# Altium schematic sheet MotorsDrive.SchDoc: [Untitled]
size A3; Author: Nędzny Janusz; CompanyName: SensDx S.A.; Organization: SensDx S.A.; Address1: Wrocław Laboratories; SheetNumber: 1; SheetTotal: 1
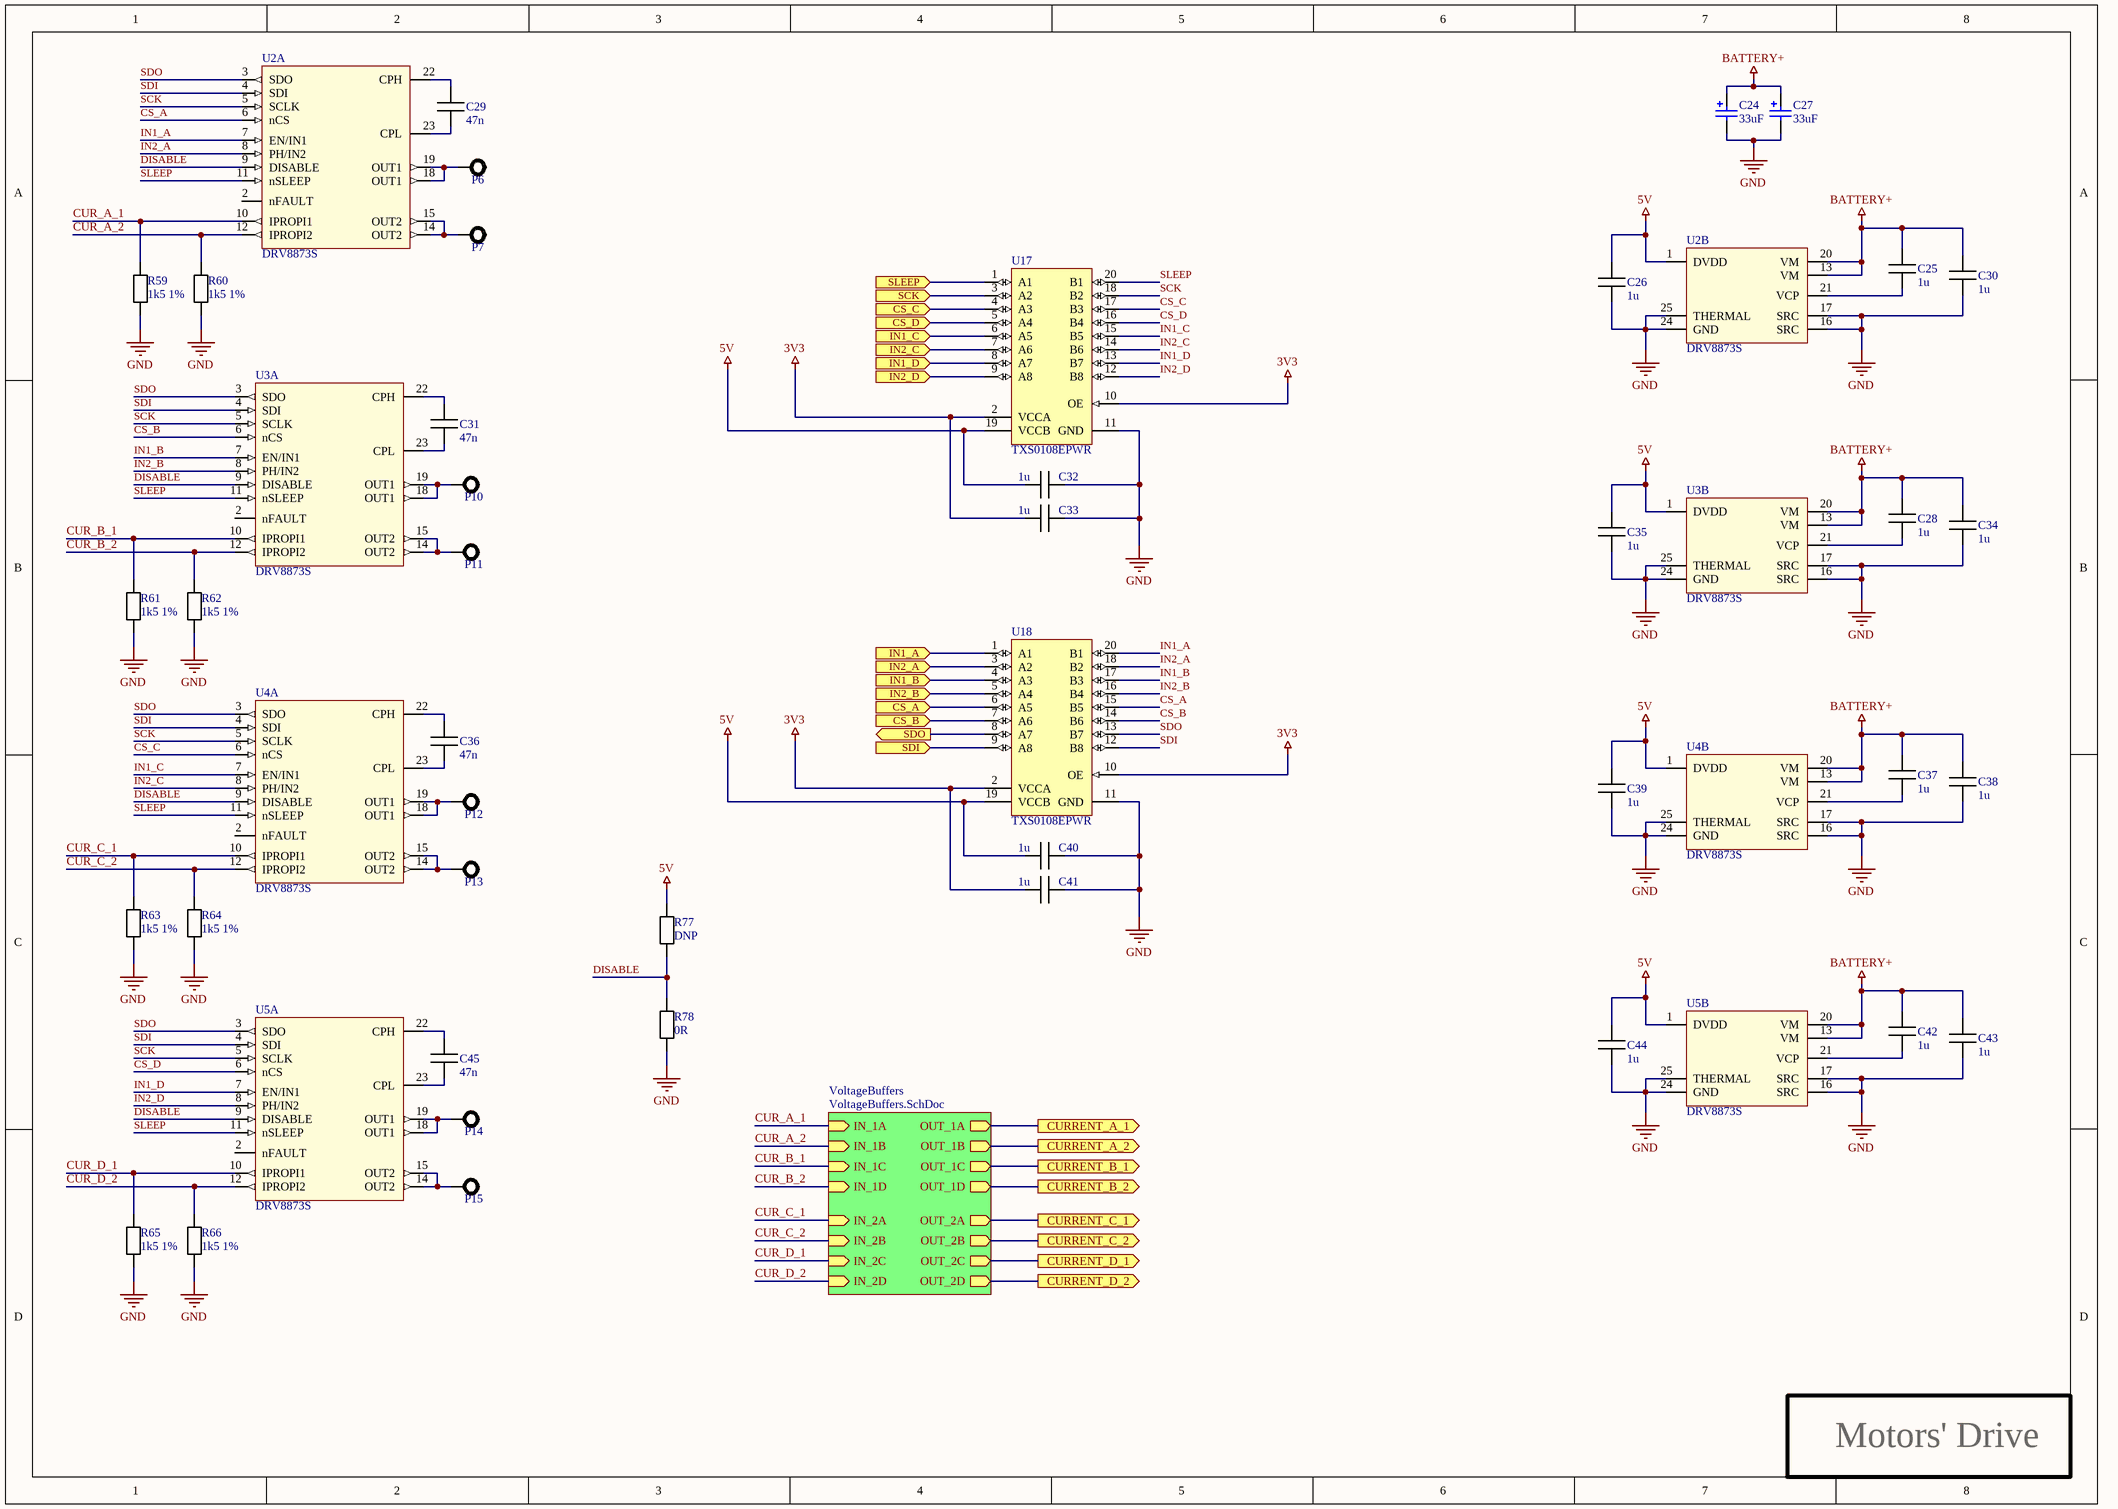
[diagram p0: MotorsDrive.SchDoc]

## Parts
C24  value 33uF  [WCAP-ASLL_6.3x5.5]  (hidden comment: 865060543004)
C25  1u  [C_0603_AUTO]
C26  1u  [C_0603_AUTO]
C27  value 33uF  [WCAP-ASLL_6.3x5.5]  (hidden comment: 865060543004)
C28  1u  [C_0603_AUTO]
C29  47n  [C_0603_AUTO]
C30  1u  [C_0603_AUTO]
C31  47n  [C_0603_AUTO]
C32  1u  [C_0603_AUTO]
C33  1u  [C_0603_AUTO]
C34  1u  [C_0603_AUTO]
C35  1u  [C_0603_AUTO]
C36  47n  [C_0603_AUTO]
C37  1u  [C_0603_AUTO]
C38  1u  [C_0603_AUTO]
C39  1u  [C_0603_AUTO]
C40  1u  [C_0603_AUTO]
C41  1u  [C_0603_AUTO]
C42  1u  [C_0603_AUTO]
C43  1u  [C_0603_AUTO]
C44  1u  [C_0603_AUTO]
C45  47n  [C_0603_AUTO]
P6  1x2mm  [PAD 1x2mm]  (value not drawn)
P7  1x2mm  [PAD 1x2mm]  (value not drawn)
P10  1x2mm  [PAD 1x2mm]  (value not drawn)
P11  1x2mm  [PAD 1x2mm]  (value not drawn)
P12  1x2mm  [PAD 1x2mm]  (value not drawn)
P13  1x2mm  [PAD 1x2mm]  (value not drawn)
P14  1x2mm  [PAD 1x2mm]  (value not drawn)
P15  1x2mm  [PAD 1x2mm]  (value not drawn)
R59  1k5 1%  [R_0603_AUTO]
R60  1k5 1%  [R_0603_AUTO]
R61  1k5 1%  [R_0603_AUTO]
R62  1k5 1%  [R_0603_AUTO]
R63  1k5 1%  [R_0603_AUTO]
R64  1k5 1%  [R_0603_AUTO]
R65  1k5 1%  [R_0603_AUTO]
R66  1k5 1%  [R_0603_AUTO]
R77  DNP  [R_0603_AUTO]
R78  0R  [R_0603_AUTO]
U2  DRV8873S  [SSOP24-TH_HAND]  (parts A,B of 2)
U3  DRV8873S  [SSOP24-TH_HAND]  (parts A,B of 2)
U4  DRV8873S  [SSOP24-TH_HAND]  (parts A,B of 2)
U5  DRV8873S  [SSOP24-TH_HAND]  (parts A,B of 2)
U17  TXS0108EPWR  [PW0020A_M]
U18  TXS0108EPWR  [PW0020A_M]

## Sub-sheets
VoltageBuffers = VoltageBuffers.SchDoc: OUT_1A (out), IN_2A (in), OUT_2D (out), IN_2B (in), OUT_1D (out), IN_1B (in), IN_1C (in), IN_1D (in), OUT_1B (out), OUT_2C (out), OUT_2B (out), IN_2D (in), IN_1A (in), OUT_1C (out), IN_2C (in), OUT_2A (out)

## Ports
CS_A (in), CS_B (in), CS_C (in), CS_D (in), CURRENT_A_1 (out), CURRENT_A_2 (out), CURRENT_B_1 (out), CURRENT_B_2 (out), CURRENT_C_1 (out), CURRENT_C_2 (out), CURRENT_D_1 (out), CURRENT_D_2 (out), IN1_A (in), IN1_B (in), IN1_C (in), IN1_D (in), IN2_A (in), IN2_B (in), IN2_C (in), IN2_D (in), SCK (in), SDI (in), SDO (out), SLEEP (in)

## Nets
3V3: C33.2 C41.2 U17.2(VCCA) U17.10(OE) U18.2(VCCA) U18.10(OE)
5V: C26.2 C32.2 C35.2 C39.2 C40.2 C44.2 R77.2 U2.1(DVDD) U3.1(DVDD) U4.1(DVDD) U5.1(DVDD) U17.19(VCCB) U18.19(VCCB)
BATTERY+: C24.1(P) C25.2 C27.1(P) C28.2 C30.2 C34.2 C37.2 C38.2 C42.2 C43.2 U2.13(VM) U2.20(VM) U3.13(VM) U3.20(VM) U4.13(VM) U4.20(VM) U5.13(VM) U5.20(VM)
GND: C24.2(N) C26.1 C27.2(N) C30.1 C32.1 C33.1 C34.1 C35.1 C38.1 C39.1 C40.1 C41.1 C43.1 C44.1 R59.1 R60.1 R61.1 R62.1 R63.1 R64.1 R65.1 R66.1 R78.1 U2.16(SRC) U2.17(SRC) U2.24(GND) U2.25(THERMAL) U3.16(SRC) U3.17(SRC) U3.24(GND) U3.25(THERMAL) U4.16(SRC) U4.17(SRC) U4.24(GND) U4.25(THERMAL) U5.16(SRC) U5.17(SRC) U5.24(GND) U5.25(THERMAL) U17.11(GND) U18.11(GND)
CS_A: U2.6(nCS) U18.15(B5)
CS_A: U18.6(A5) ; port CS_A  [a separate net that carries the same name]
CS_B: U3.6(nCS) U18.14(B6)
CS_B: U18.7(A6) ; port CS_B  [a separate net that carries the same name]
CS_C: U4.6(nCS) U17.17(B3)
CS_C: U17.4(A3) ; port CS_C  [a separate net that carries the same name]
CS_D: U5.6(nCS) U17.16(B4)
CS_D: U17.5(A4) ; port CS_D  [a separate net that carries the same name]
CUR_A_1: R59.2 U2.10(IPROPI1) ; sheet VoltageBuffers/IN_1A
CUR_A_2: R60.2 U2.12(IPROPI2) ; sheet VoltageBuffers/IN_1B
CUR_B_1: R61.2 U3.10(IPROPI1) ; sheet VoltageBuffers/IN_1C
CUR_B_2: R62.2 U3.12(IPROPI2) ; sheet VoltageBuffers/IN_1D
CUR_C_1: R63.2 U4.10(IPROPI1) ; sheet VoltageBuffers/IN_2A
CUR_C_2: R64.2 U4.12(IPROPI2) ; sheet VoltageBuffers/IN_2B
CUR_D_1: R65.2 U5.10(IPROPI1) ; sheet VoltageBuffers/IN_2C
CUR_D_2: R66.2 U5.12(IPROPI2) ; sheet VoltageBuffers/IN_2D
CURRENT_A_1: port CURRENT_A_1, sheet VoltageBuffers/OUT_1A
CURRENT_A_2: port CURRENT_A_2, sheet VoltageBuffers/OUT_1B
CURRENT_B_1: port CURRENT_B_1, sheet VoltageBuffers/OUT_1C
CURRENT_B_2: port CURRENT_B_2, sheet VoltageBuffers/OUT_1D
CURRENT_C_1: port CURRENT_C_1, sheet VoltageBuffers/OUT_2A
CURRENT_C_2: port CURRENT_C_2, sheet VoltageBuffers/OUT_2B
CURRENT_D_1: port CURRENT_D_1, sheet VoltageBuffers/OUT_2C
CURRENT_D_2: port CURRENT_D_2, sheet VoltageBuffers/OUT_2D
DISABLE: R77.1 R78.2 U2.9(DISABLE) U3.9(DISABLE) U4.9(DISABLE) U5.9(DISABLE)
IN1_A: U2.7(EN/IN1) U18.20(B1)
IN1_A: U18.1(A1) ; port IN1_A  [a separate net that carries the same name]
IN1_B: U3.7(EN/IN1) U18.17(B3)
IN1_B: U18.4(A3) ; port IN1_B  [a separate net that carries the same name]
IN1_C: U4.7(EN/IN1) U17.15(B5)
IN1_C: U17.6(A5) ; port IN1_C  [a separate net that carries the same name]
IN1_D: U5.7(EN/IN1) U17.13(B7)
IN1_D: U17.8(A7) ; port IN1_D  [a separate net that carries the same name]
IN2_A: U2.8(PH/IN2) U18.18(B2)
IN2_A: U18.3(A2) ; port IN2_A  [a separate net that carries the same name]
IN2_B: U3.8(PH/IN2) U18.16(B4)
IN2_B: U18.5(A4) ; port IN2_B  [a separate net that carries the same name]
IN2_C: U4.8(PH/IN2) U17.14(B6)
IN2_C: U17.7(A6) ; port IN2_C  [a separate net that carries the same name]
IN2_D: U5.8(PH/IN2) U17.12(B8)
IN2_D: U17.9(A8) ; port IN2_D  [a separate net that carries the same name]
SCK: U2.5(SCLK) U3.5(SCLK) U4.5(SCLK) U5.5(SCLK) U17.18(B2)
SCK: U17.3(A2) ; port SCK  [a separate net that carries the same name]
SDI: U2.4(SDI) U3.4(SDI) U4.4(SDI) U5.4(SDI) U18.12(B8)
SDI: U18.9(A8) ; port SDI  [a separate net that carries the same name]
SDO: U2.3(SDO) U3.3(SDO) U4.3(SDO) U5.3(SDO) U18.13(B7)
SDO: U18.8(A7) ; port SDO  [a separate net that carries the same name]
SLEEP: U2.11(nSLEEP) U3.11(nSLEEP) U4.11(nSLEEP) U5.11(nSLEEP) U17.20(B1)
SLEEP: U17.1(A1) ; port SLEEP  [a separate net that carries the same name]
NetC25_1: C25.1 U2.21(VCP)
NetC28_1: C28.1 U3.21(VCP)
NetC29_1: C29.1 U2.23(CPL)
NetC29_2: C29.2 U2.22(CPH)
NetC31_1: C31.1 U3.23(CPL)
NetC31_2: C31.2 U3.22(CPH)
NetC36_1: C36.1 U4.23(CPL)
NetC36_2: C36.2 U4.22(CPH)
NetC37_1: C37.1 U4.21(VCP)
NetC42_1: C42.1 U5.21(VCP)
NetC45_1: C45.1 U5.23(CPL)
NetC45_2: C45.2 U5.22(CPH)
NetP6_1: P6.1 U2.18(OUT1) U2.19(OUT1)
NetP7_1: P7.1 U2.14(OUT2) U2.15(OUT2)
NetP10_1: P10.1 U3.18(OUT1) U3.19(OUT1)
NetP11_1: P11.1 U3.14(OUT2) U3.15(OUT2)
NetP12_1: P12.1 U4.18(OUT1) U4.19(OUT1)
NetP13_1: P13.1 U4.14(OUT2) U4.15(OUT2)
NetP14_1: P14.1 U5.18(OUT1) U5.19(OUT1)
NetP15_1: P15.1 U5.14(OUT2) U5.15(OUT2)

Not connected (* = marked no-connect by the designer): U2 2(nFAULT); U3 2(nFAULT); U4 2(nFAULT); U5 2(nFAULT)

## Notes on the sheet
- Motors' Drive
- Title:
- Project name:
- Last modification:
- Author:
- Version control rev.:
- Sheet:
- /
- Sheet size:
- Variant:
- File name:
- A3
- Altium build:

## Library data of the parts
C24 C27 = 865060543004: WCAP-ASLL Aluminum Electrolytic Capacitors, size Ф6.3x5.5mm, 35V DC, 33uF; Rated Voltage: 35V DC; ComponentLink1Description: Manufacturer; ComponentLink1URL: http://www.we-online.de; ComponentLink2Description: Datasheet; ComponentLink2URL: http://katalog.we-online.de/pbs/datasheet/865060543004.pdf; Part Number: 865060543004; Published Date: June 2017; Publisher: Wurth Elektronik; Size: Ф6.3x5.5mm; Life Cycle: 2000h; Operating Temperature: -55 °C up to +105 °C
C25 C26 C28-C45 = Capacitor: Manufacturer: [Generic]; MPN: [Generic]
  C25 C26 C28 C30 C32-C35 C37-C44: Value: 1u
  C29 C31 C36 C45: Value: 47n
P6 P7 P10-P15 = PAD_small: copper pad; Manufacturer: NA; Value: NA; MPN: NA
R59-R66 R77 R78 = Resistor: MPN: [Generic]; Manufacturer: [Generic]
  R59-R66: Value: 1k5 1%
  R77: Value: DNP
  R78: Value: 0R
U2-U5 = DRV8873S: 10A H-Bridge Motor Driver with Integrated Current Sensing and Current Sense Output; Manufacturer: Texas Instruments; Value: NA; MPN: DRV8873S; ComponentLink1Description: Datasheet; ComponentLink1URL: http://www.ti.com/lit/ds/symlink/drv8873.pdf; ComponentLink2Description: Product page; ComponentLink2URL: http://www.ti.com/product/DRV8873; Supplier 1: Digi-Key; Supplier 2: Mouser; Supplier Part Number 2: 595-DRV8873SPWPRQ1; Supplier Part Number 1: 296-50275-6-ND
U17 U18 = CMP-2000-04956-1: Bidirectional Voltage-Level Translator for Open-Drain and Push-Pull Application, 8 bit, 1.2 to 3.6 V, -40 to 85 degC, 20-Pin TSSOP, Green (RoHS & no Sb/Br), Tape and Reel; Manufacturer: Texas Instruments; Logic Type: VoltageLevelTranslator; Output Current: 620µA; Propagation Delay: 4.8ns; Supply Voltage Min: 1.2V; No. of Inputs: 8; Supply Voltage Max: 5.5V; SVHC: NoSVHC(16-Jun-2014); No. of Pins: 20; Datasheet URL: https://datasheet.ciiva.com/14287/txs0108e-14287280.pdf; Operating Temperature Min: -40degC; Logic Case Style: TSSOP; Packaging: CutTape; Datasheet Version: Rev. B, 09/2008; MSL: MSL1-Unlimited; Manufacturer URL: http://www.ti.com/; Operating Temperature Max: 85degC